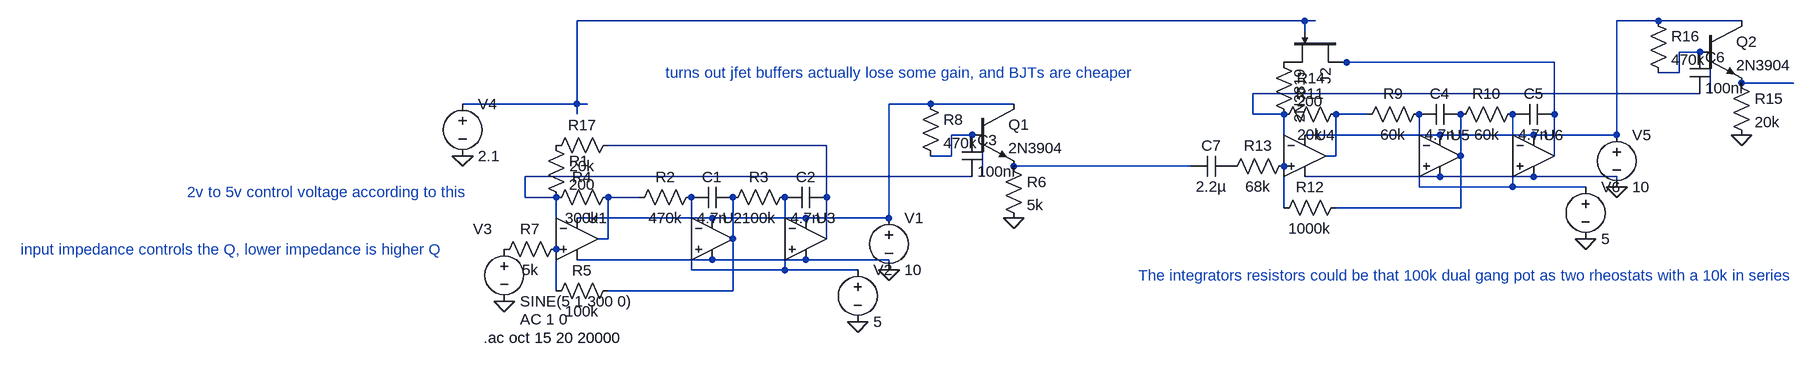
[diagram p0: schematic StateVariableFilterVoltageCTRL.asc]
StateVariableFilterVoltageCTRL.asc, the LTspice schematic file:
Version 4
SHEET 1 2124 680
WIRE 1264 -160 144 -160
WIRE 1280 -160 1264 -160
WIRE 1808 -160 1744 -160
WIRE 1936 -160 1808 -160
WIRE 1264 -144 1264 -160
WIRE 1872 -112 1840 -112
WIRE 1888 -112 1872 -112
WIRE 1328 -96 1312 -96
WIRE 1648 -96 1328 -96
WIRE 1840 -80 1840 -112
WIRE 1840 -80 1808 -80
WIRE 2016 -64 1936 -64
WIRE 1872 -48 1184 -48
WIRE 1888 -48 1888 -96
WIRE 144 -32 144 -160
WIRE 144 -32 -32 -32
WIRE 160 -32 144 -32
WIRE 688 -32 624 -32
WIRE 816 -32 688 -32
WIRE 144 -16 144 -32
WIRE 1184 -16 1184 -48
WIRE 1232 -16 1184 -16
WIRE 1360 -16 1312 -16
WIRE 1648 -16 1648 -96
WIRE 752 16 720 16
WIRE 768 16 752 16
WIRE 1472 16 1264 16
WIRE 1616 16 1472 16
WIRE 1744 16 1744 -160
WIRE 1744 16 1616 16
WIRE 528 32 192 32
WIRE 1232 32 1232 -16
WIRE 1440 32 1440 -16
WIRE 1584 32 1584 -16
WIRE 720 48 720 16
WIRE 720 48 688 48
WIRE 1312 48 1312 -16
WIRE 1312 48 1296 48
WIRE 1504 48 1504 -16
WIRE 1648 48 1648 -16
WIRE 1088 64 816 64
WIRE 752 80 64 80
WIRE 768 80 768 32
WIRE 1472 80 1264 80
WIRE 1616 80 1472 80
WIRE 1744 80 1616 80
WIRE 1440 96 1440 64
WIRE 1584 96 1584 64
WIRE 1584 96 1440 96
WIRE 1696 96 1584 96
WIRE 1744 96 1744 80
WIRE 64 112 64 80
WIRE 112 112 64 112
WIRE 240 112 192 112
WIRE 528 112 528 32
WIRE 1232 128 1232 64
WIRE 1504 128 1504 48
WIRE 1504 128 1312 128
WIRE 352 144 144 144
WIRE 496 144 352 144
WIRE 624 144 624 -32
WIRE 624 144 496 144
WIRE 112 160 112 112
WIRE 320 160 320 112
WIRE 464 160 464 112
WIRE 192 176 192 112
WIRE 192 176 176 176
WIRE 384 176 384 112
WIRE 528 176 528 112
WIRE 352 208 144 208
WIRE 496 208 352 208
WIRE 624 208 496 208
WIRE 320 224 320 192
WIRE 464 224 464 192
WIRE 464 224 320 224
WIRE 576 224 464 224
WIRE 624 224 624 208
WIRE 112 256 112 192
WIRE 384 256 384 176
WIRE 384 256 192 256
FLAG 624 224 0
FLAG 576 304 0
FLAG 32 272 0
FLAG -32 48 0
FLAG 816 144 0
FLAG 1744 96 0
FLAG 1696 176 0
FLAG 1936 16 0
SYMBOL Opamps\\UniversalOpamp2 144 176 R0
SYMATTR InstName U1
SYMBOL Opamps\\UniversalOpamp2 352 176 R0
SYMATTR InstName U2
SYMBOL voltage 624 128 R0
WINDOW 123 0 0 Left 0
WINDOW 39 0 0 Left 0
SYMATTR InstName V1
SYMATTR Value 10
SYMBOL cap 384 96 R90
WINDOW 0 0 32 VBottom 2
WINDOW 3 32 32 VTop 2
SYMATTR InstName C1
SYMATTR Value 4.7n
SYMBOL res 336 96 R90
WINDOW 0 0 56 VBottom 2
WINDOW 3 32 56 VTop 2
SYMATTR InstName R2
SYMATTR Value 470k
SYMBOL voltage 576 208 R0
WINDOW 123 0 0 Left 0
WINDOW 39 0 0 Left 0
SYMATTR InstName V2
SYMATTR Value 5
SYMBOL Opamps\\UniversalOpamp2 496 176 R0
SYMATTR InstName U3
SYMBOL cap 528 96 R90
WINDOW 0 0 32 VBottom 2
WINDOW 3 32 32 VTop 2
SYMATTR InstName C2
SYMATTR Value 4.7n
SYMBOL res 480 96 R90
WINDOW 0 0 56 VBottom 2
WINDOW 3 32 56 VTop 2
SYMATTR InstName R3
SYMATTR Value 100k
SYMBOL res 208 96 R90
WINDOW 0 0 56 VBottom 2
WINDOW 3 32 56 VTop 2
SYMATTR InstName R4
SYMATTR Value 300k
SYMBOL res 208 240 R90
WINDOW 0 0 56 VBottom 2
WINDOW 3 32 56 VTop 2
SYMATTR InstName R5
SYMATTR Value 100k
SYMBOL res 128 176 R90
WINDOW 0 0 56 VBottom 2
WINDOW 3 32 56 VTop 2
SYMATTR InstName R7
SYMATTR Value 5k
SYMBOL voltage 32 176 R0
WINDOW 0 -48 -15 Left 2
WINDOW 123 24 124 Left 2
WINDOW 39 0 0 Left 0
SYMATTR InstName V3
SYMATTR Value2 AC 1 0
SYMATTR Value SINE(5 1 300 0)
SYMBOL res 96 16 R0
SYMATTR InstName R1
SYMATTR Value 200
SYMBOL voltage -32 -48 R0
WINDOW 123 0 0 Left 0
WINDOW 39 0 0 Left 0
SYMATTR InstName V4
SYMATTR Value 2.1
SYMBOL res 800 48 R0
SYMATTR InstName R6
SYMATTR Value 5k
SYMBOL npn 752 -32 R0
SYMATTR InstName Q1
SYMATTR Value 2N3904
SYMBOL cap 736 16 R0
SYMATTR InstName C3
SYMATTR Value 100nf
SYMBOL res 672 -48 R0
SYMATTR InstName R8
SYMATTR Value 470k
SYMBOL Opamps\\UniversalOpamp2 1264 48 R0
SYMATTR InstName U4
SYMBOL Opamps\\UniversalOpamp2 1472 48 R0
SYMATTR InstName U5
SYMBOL voltage 1744 0 R0
WINDOW 123 0 0 Left 0
WINDOW 39 0 0 Left 0
SYMATTR InstName V5
SYMATTR Value 10
SYMBOL cap 1504 -32 R90
WINDOW 0 0 32 VBottom 2
WINDOW 3 32 32 VTop 2
SYMATTR InstName C4
SYMATTR Value 4.7n
SYMBOL res 1456 -32 R90
WINDOW 0 0 56 VBottom 2
WINDOW 3 32 56 VTop 2
SYMATTR InstName R9
SYMATTR Value 60k
SYMBOL voltage 1696 80 R0
WINDOW 123 0 0 Left 0
WINDOW 39 0 0 Left 0
SYMATTR InstName V6
SYMATTR Value 5
SYMBOL Opamps\\UniversalOpamp2 1616 48 R0
SYMATTR InstName U6
SYMBOL cap 1648 -32 R90
WINDOW 0 0 32 VBottom 2
WINDOW 3 32 32 VTop 2
SYMATTR InstName C5
SYMATTR Value 4.7n
SYMBOL res 1600 -32 R90
WINDOW 0 0 56 VBottom 2
WINDOW 3 32 56 VTop 2
SYMATTR InstName R10
SYMATTR Value 60k
SYMBOL res 1328 -32 R90
WINDOW 0 0 56 VBottom 2
WINDOW 3 32 56 VTop 2
SYMATTR InstName R11
SYMATTR Value 20k
SYMBOL res 1328 112 R90
WINDOW 0 0 56 VBottom 2
WINDOW 3 32 56 VTop 2
SYMATTR InstName R12
SYMATTR Value 1000k
SYMBOL res 1248 48 R90
WINDOW 0 0 56 VBottom 2
WINDOW 3 32 56 VTop 2
SYMATTR InstName R13
SYMATTR Value 68k
SYMBOL res 1216 -112 R0
SYMATTR InstName R14
SYMATTR Value 200
SYMBOL njf 1328 -144 R90
SYMATTR InstName J2
SYMATTR Value 2N3819
SYMBOL res 1920 -80 R0
SYMATTR InstName R15
SYMATTR Value 20k
SYMBOL npn 1872 -160 R0
SYMATTR InstName Q2
SYMATTR Value 2N3904
SYMBOL cap 1856 -112 R0
SYMATTR InstName C6
SYMATTR Value 100nf
SYMBOL res 1792 -176 R0
SYMATTR InstName R16
SYMATTR Value 470k
SYMBOL cap 1152 48 R90
WINDOW 0 0 32 VBottom 2
WINDOW 3 32 32 VTop 2
SYMATTR InstName C7
SYMATTR Value 2.2µ
SYMBOL res 208 16 R90
WINDOW 0 0 56 VBottom 2
WINDOW 3 32 56 VTop 2
SYMATTR InstName R17
SYMATTR Value 20k
TEXT 0 328 Left 2 !.ac oct 15 20 20000
TEXT -456 104 Left 2 ;2v to 5v control voltage according to this
TEXT -712 192 Left 2 ;input impedance controls the Q, lower impedance is higher Q
TEXT 280 -80 Left 2 ;turns out jfet buffers actually lose some gain, and BJTs are cheaper
TEXT 1008 232 Left 2 ;The integrators resistors could be that 100k dual gang pot as two rheostats with a 10k in series

The netlist it stands for:
* StateVariableFilterVoltageCTRL.asc
XU1 N025 N016 N008 0 N019 level.2 Avol=1Meg GBW=10Meg Slew=10Meg ilimit=25m rail=0 Vos=0 phimargin=45 en=0 enk=0 in=0 ink=0 Rin=500Meg  ; pins IN+ IN- V+ V- OUT
XU2 N024 N021 N008 0 N023 level.2 Avol=1Meg GBW=10Meg Slew=10Meg ilimit=25m rail=0 Vos=0 phimargin=45 en=0 enk=0 in=0 ink=0 Rin=500Meg  ; pins IN+ IN- V+ V- OUT
V1 N008 0 10
C1 N023 N021 4.7n
R2 N021 N019 470k
V2 N024 0 5
XU3 N024 N022 N008 0 N011 level.2 Avol=1Meg GBW=10Meg Slew=10Meg ilimit=25m rail=0 Vos=0 phimargin=45 en=0 enk=0 in=0 ink=0 Rin=500Meg  ; pins IN+ IN- V+ V- OUT
C2 N011 N022 4.7n
R3 N022 N023 100k
R4 N019 N016 300k
R5 N023 N025 100k
R7 N025 P001 5k
V3 P001 0 SINE(5 1 300 0) AC 1 0
R1 P002 N016 200
V4 N001 0 2.1
R6 N015 0 5k
Q1 N008 N010 N015 0 2N3904
C3 N010 N016 100nf
R8 N008 N010 470k
XU4 N020 N006 N002 0 N009 level.2 Avol=1Meg GBW=10Meg Slew=10Meg ilimit=25m rail=0 Vos=0 phimargin=45 en=0 enk=0 in=0 ink=0 Rin=500Meg  ; pins IN+ IN- V+ V- OUT
XU5 N018 N012 N002 0 N014 level.2 Avol=1Meg GBW=10Meg Slew=10Meg ilimit=25m rail=0 Vos=0 phimargin=45 en=0 enk=0 in=0 ink=0 Rin=500Meg  ; pins IN+ IN- V+ V- OUT
V5 N002 0 10
C4 N014 N012 4.7n
R9 N012 N009 60k
V6 N018 0 5
XU6 N018 N013 N002 0 N004 level.2 Avol=1Meg GBW=10Meg Slew=10Meg ilimit=25m rail=0 Vos=0 phimargin=45 en=0 enk=0 in=0 ink=0 Rin=500Meg  ; pins IN+ IN- V+ V- OUT
C5 N004 N013 4.7n
R10 N013 N014 60k
R11 N009 N006 20k
R12 N014 N020 1000k
R13 N020 P003 68k
R14 P004 N006 200
J2 N004 N001 P004 2N3819
R15 N005 0 20k
Q2 N002 N003 N005 0 2N3904
C6 N003 N006 100nf
R16 N002 N003 470k
C7 P003 N015 2.2µ
R17 N011 P002 20k
.model NPN NPN
.model PNP PNP
.lib standard.bjt
.model NJF NJF
.model PJF PJF
.lib standard.jft
.ac oct 15 20 20000
* 2v to 5v control voltage according to this
* input impedance controls the Q, lower impedance is higher Q
* turns out jfet buffers actually lose some gain, and BJTs are cheaper
* The integrators resistors could be that 100k dual gang pot as two rheostats with a 10k in series
.lib UniversalOpamps2.sub
.backanno
.end